# Altium schematic sheet I2C_Switch_I2C_EEPROM.SchDoc
size B; SheetNumber: 2; SheetTotal: 11
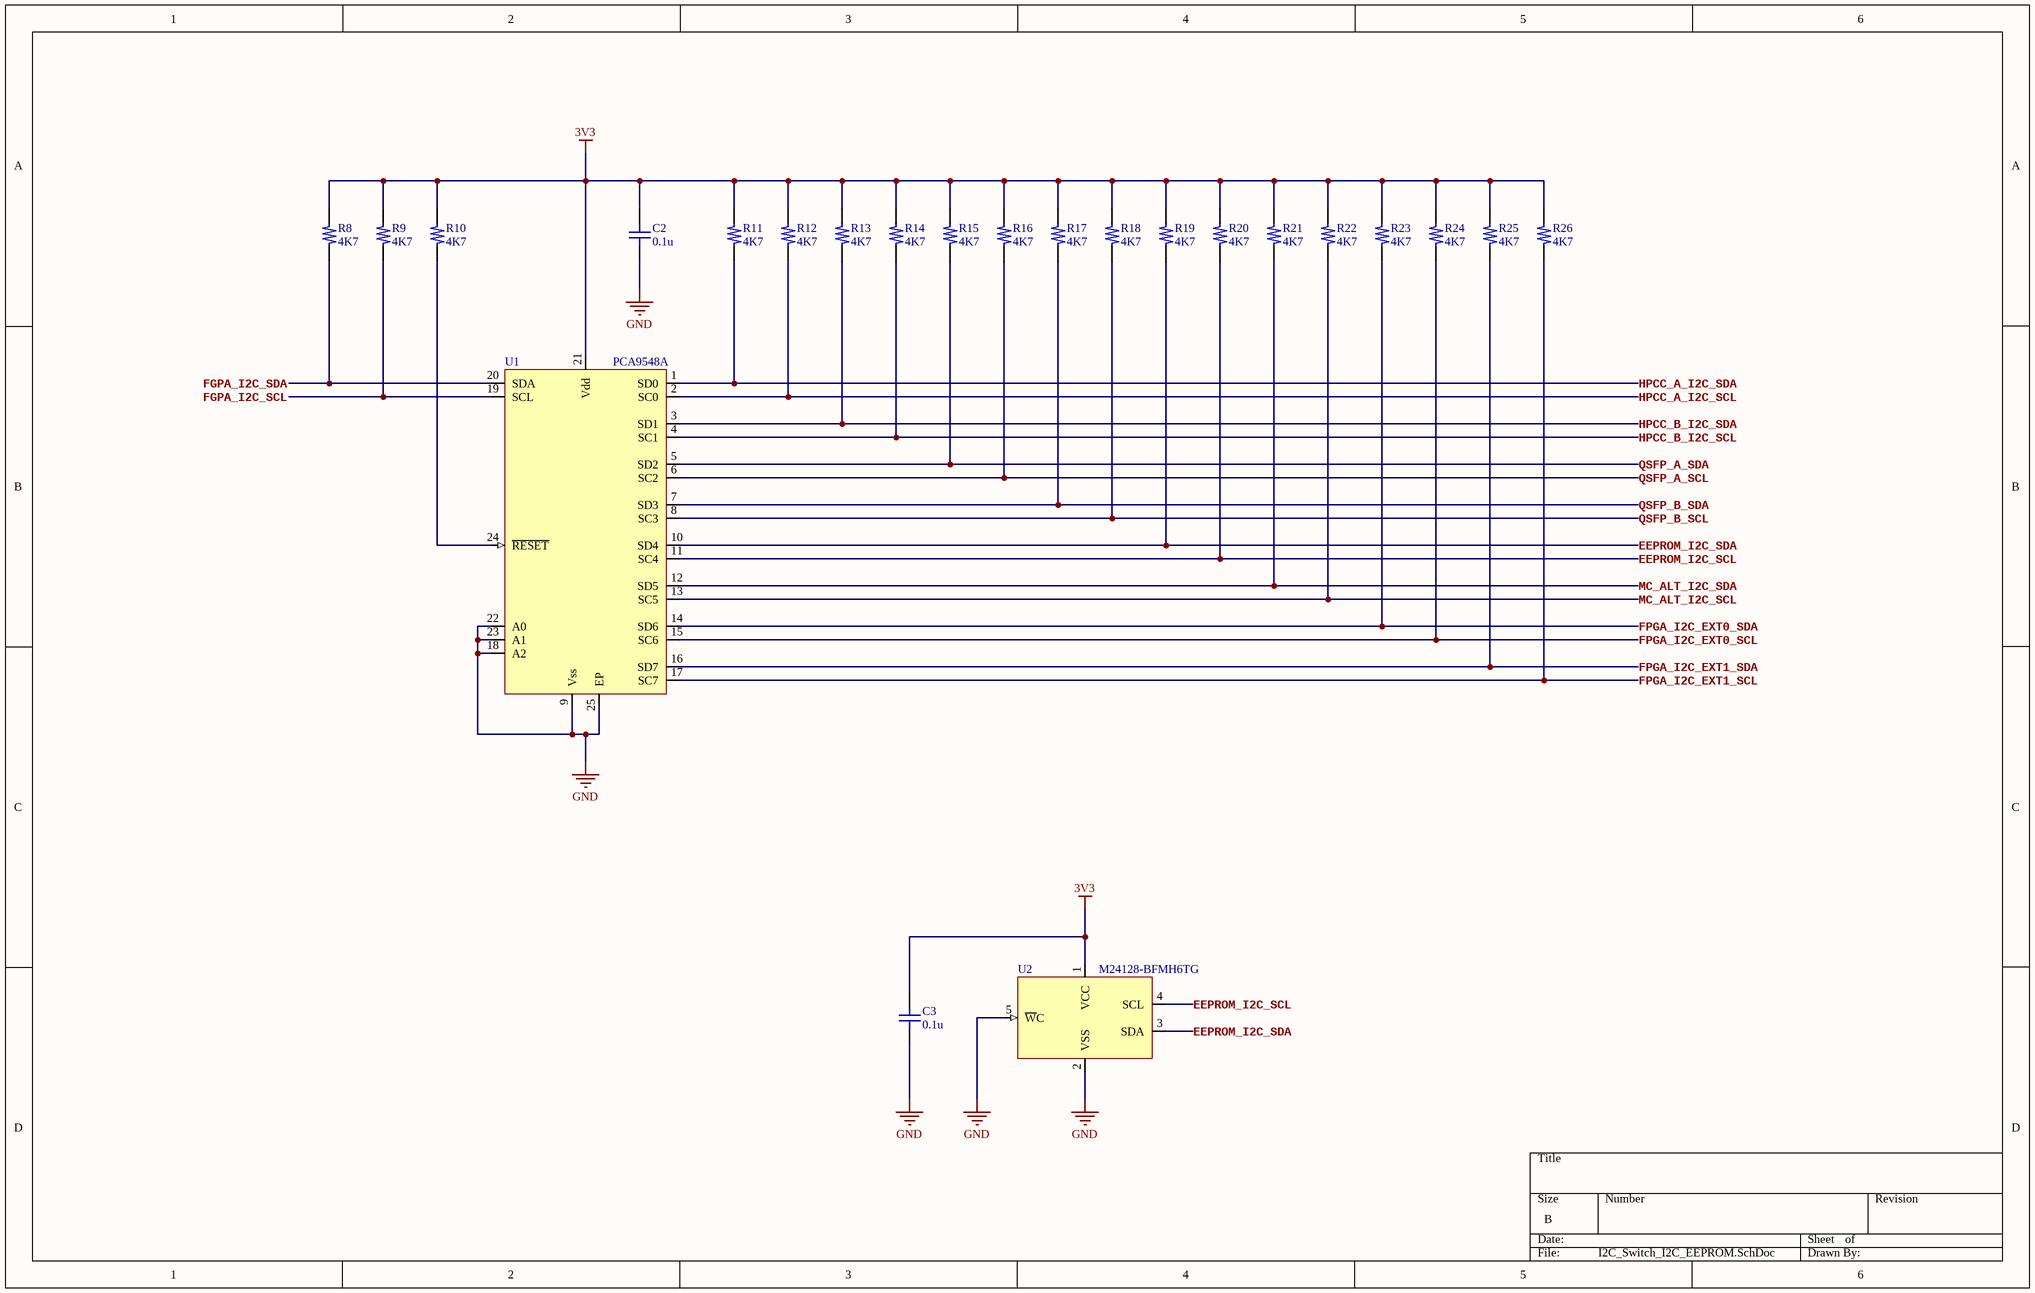
[diagram p0: I2C_Switch_I2C_EEPROM.SchDoc]

## Parts
C2  0.1u  [C_0402_Generic]
C3  0.1u  [C_0402_Generic]
R8  4K7  [R_0402_Generic]
R9  4K7  [R_0402_Generic]
R10  4K7  [R_0402_Generic]
R11  4K7  [R_0402_Generic]
R12  4K7  [R_0402_Generic]
R13  4K7  [R_0402_Generic]
R14  4K7  [R_0402_Generic]
R15  4K7  [R_0402_Generic]
R16  4K7  [R_0402_Generic]
R17  4K7  [R_0402_Generic]
R18  4K7  [R_0402_Generic]
R19  4K7  [R_0402_Generic]
R20  4K7  [R_0402_Generic]
R21  4K7  [R_0402_Generic]
R22  4K7  [R_0402_Generic]
R23  4K7  [R_0402_Generic]
R24  4K7  [R_0402_Generic]
R25  4K7  [R_0402_Generic]
R26  4K7  [R_0402_Generic]
U1  PCA9548A  [HVQFN24_NXP]
U2  M24128-BFMH6TG  [STM_DFN5]

## Nets
3V3: C2.2 C3.2 R8.2 R9.2 R10.2 R11.2 R12.2 R13.2 R14.2 R15.2 R16.2 R17.2 R18.2 R19.2 R20.2 R21.2 R22.2 R23.2 R24.2 R25.2 R26.2 U1.21(Vdd) U2.1(VCC)
GND: C2.1 C3.1 U1.9(Vss) U1.18(A2) U1.22(A0) U1.23(A1) U1.25(EP) U2.2(VSS) U2.5(~{W}C)
EEPROM_I2C_SCL: R20.1 U1.11(SC4) U2.4(SCL)
EEPROM_I2C_SDA: R19.1 U1.10(SD4) U2.3(SDA)
FGPA_I2C_SCL: R9.1 U1.19(SCL)
FGPA_I2C_SDA: R8.1 U1.20(SDA)
FPGA_I2C_EXT0_SCL: R24.1 U1.15(SC6)
FPGA_I2C_EXT0_SDA: R23.1 U1.14(SD6)
FPGA_I2C_EXT1_SCL: R26.1 U1.17(SC7)
FPGA_I2C_EXT1_SDA: R25.1 U1.16(SD7)
HPCC_A_I2C_SCL: R12.1 U1.2(SC0)
HPCC_A_I2C_SDA: R11.1 U1.1(SD0)
HPCC_B_I2C_SCL: R14.1 U1.4(SC1)
HPCC_B_I2C_SDA: R13.1 U1.3(SD1)
MC_ALT_I2C_SCL: R22.1 U1.13(SC5)
MC_ALT_I2C_SDA: R21.1 U1.12(SD5)
QSFP_A_SCL: R16.1 U1.6(SC2)
QSFP_A_SDA: R15.1 U1.5(SD2)
QSFP_B_SCL: R18.1 U1.8(SC3)
QSFP_B_SDA: R17.1 U1.7(SD3)
NetR10_1: R10.1 U1.24(~{RESET})

## Library data of the parts
C2 C3 = GRM155R71C104KA88D: 0.1µF 16V X7R SMD ceramic capacitor in 0402 size; Manufacturer: Murata Electronics; Manufacturer Part Number: GRM155R71C104KA88D
R8-R26 = ERJ-2RKF4701X: 4.7KOhm 1% 1/10W SMD resistor in 0402 size; Manufacturer: Panasonic; Manufacturer Part Number: ERJ-2RKF4701X
U1 = PCA9548ABS,118: 8-channel I 2 C-bus switch, 24-HVQFN; Manufacturer: NXP; Manufacturer Part Number: PCA9548ABS,118
U2 = M24128-BFMH6TG: EEPROM 128Kbit I2C 1MHz 450 ns; Manufacturer: STMicroelectronics; Manufacturer Part Number: M24128-BFMH6TG